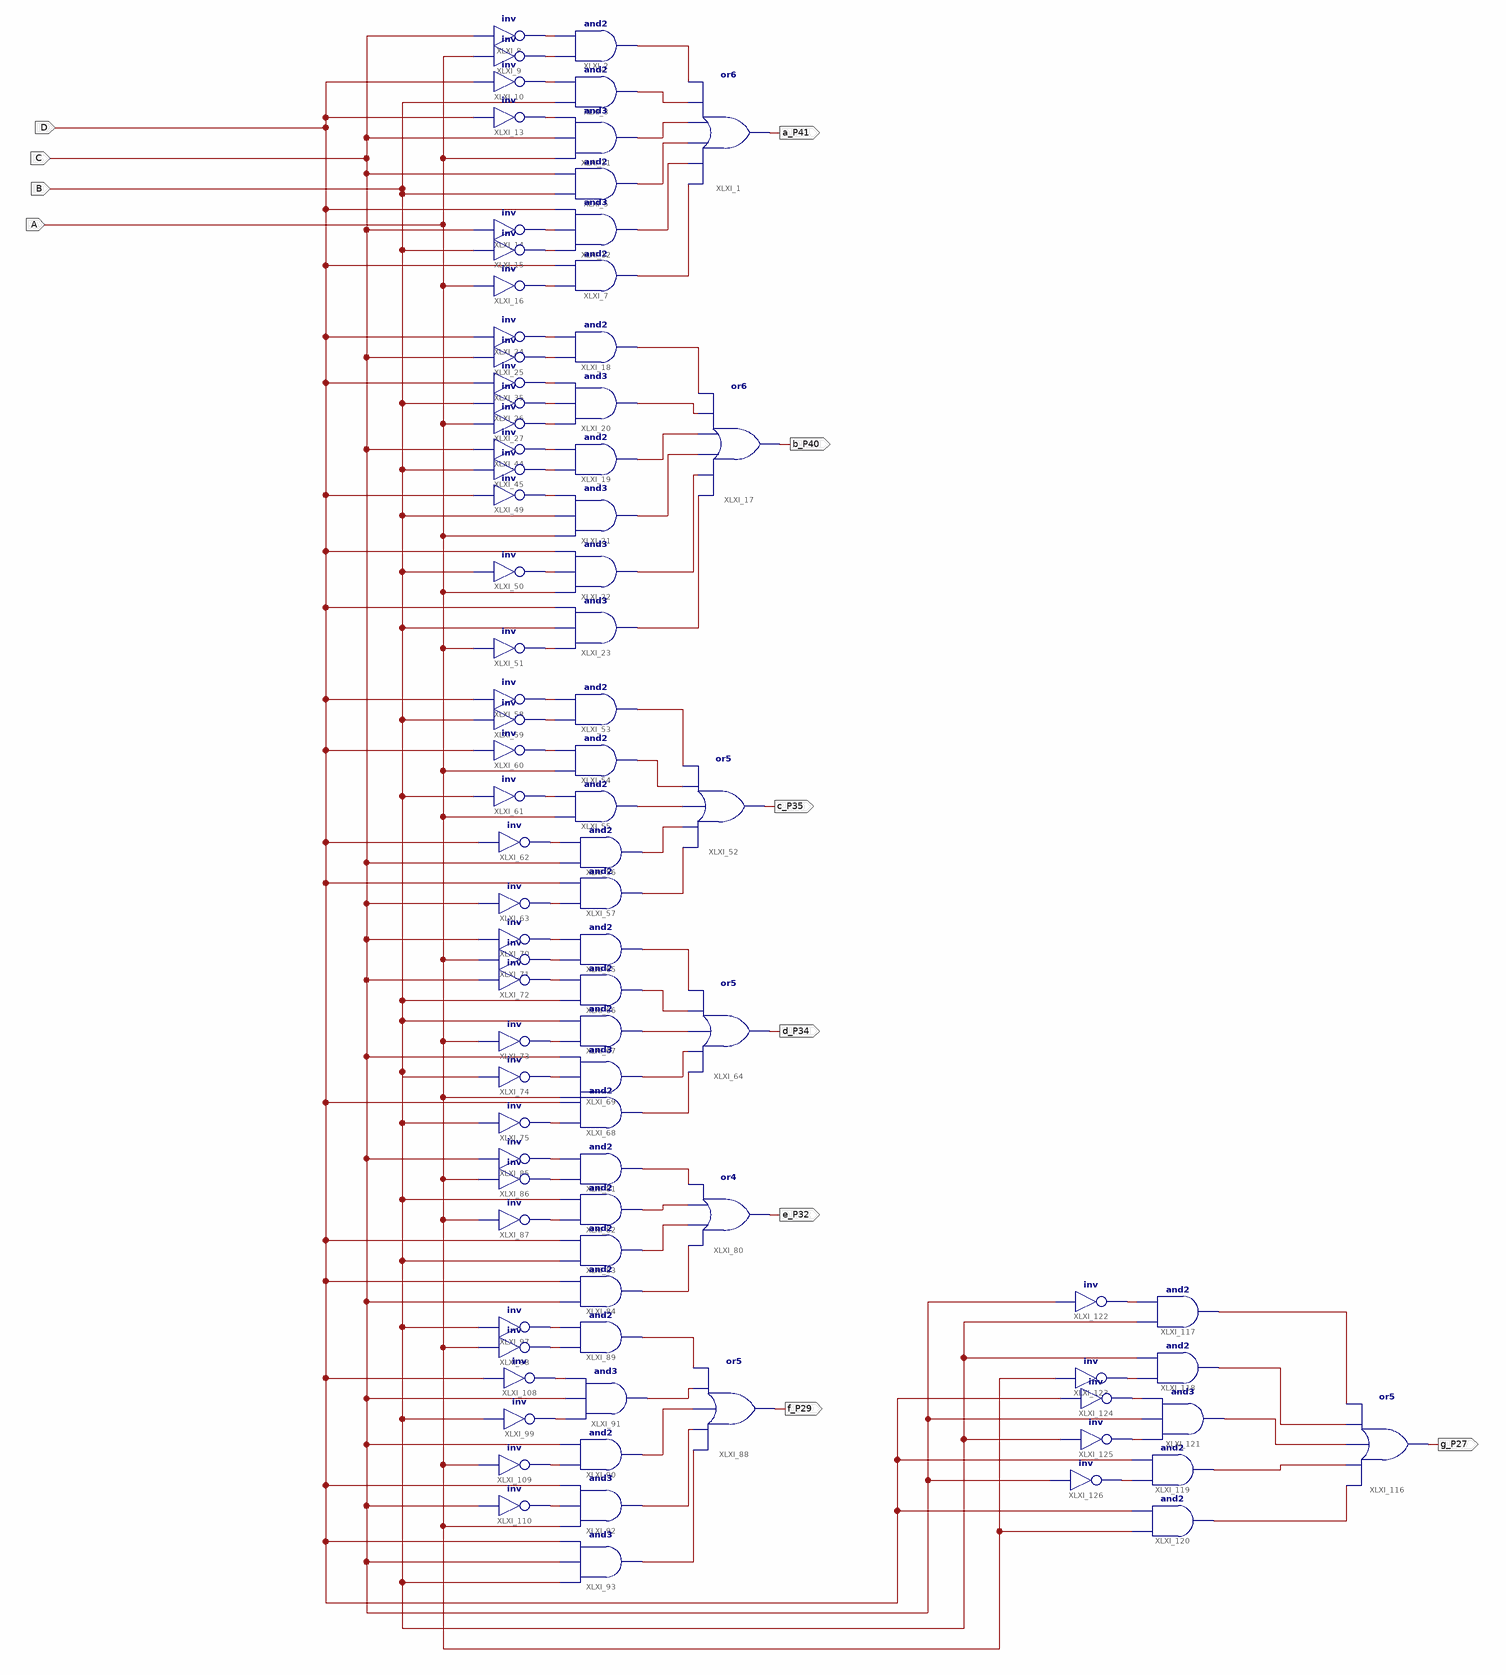
[diagram p0: schematic sheet 1]
// Xilinx ISE schematic segment.sch (spartan6) as structural Verilog: 86 symbols, 11 ports
module segment (
  input  A,
  input  B,
  input  C,
  input  D,
  output a_P41,
  output b_P40,
  output c_P35,
  output d_P34,
  output e_P32,
  output f_P29,
  output g_P27
);

  wire XLXN_2, XLXN_3, XLXN_4, XLXN_5, XLXN_6, XLXN_7, XLXN_8, XLXN_9, XLXN_10, XLXN_11, XLXN_12, XLXN_13,
       XLXN_14, XLXN_27, XLXN_28, XLXN_29, XLXN_30, XLXN_31, XLXN_32, XLXN_33, XLXN_34, XLXN_36, XLXN_37,
       XLXN_41, XLXN_46, XLXN_47, XLXN_49, XLXN_50, XLXN_51, XLXN_69, XLXN_70, XLXN_71, XLXN_72, XLXN_73,
       XLXN_74, XLXN_75, XLXN_76, XLXN_77, XLXN_78, XLXN_79, XLXN_92, XLXN_93, XLXN_94, XLXN_95, XLXN_96,
       XLXN_97, XLXN_98, XLXN_99, XLXN_100, XLXN_101, XLXN_102, XLXN_121, XLXN_122, XLXN_123, XLXN_125,
       XLXN_126, XLXN_127, XLXN_128, XLXN_138, XLXN_139, XLXN_140, XLXN_141, XLXN_142, XLXN_143, XLXN_144,
       XLXN_146, XLXN_151, XLXN_152, XLXN_153, XLXN_171, XLXN_172, XLXN_173, XLXN_174, XLXN_175, XLXN_176,
       XLXN_177, XLXN_178, XLXN_179, XLXN_180;

  or XLXI_1 (a_P41, XLXN_7, XLXN_6, XLXN_5, XLXN_4, XLXN_3, XLXN_2);
  and XLXI_2 (XLXN_2, XLXN_9, XLXN_8);
  and XLXI_3 (XLXN_3, B, XLXN_10);
  and XLXI_5 (XLXN_5, B, C);
  and XLXI_7 (XLXN_7, XLXN_14, D);
  not XLXI_8 (XLXN_8, C);
  not XLXI_9 (XLXN_9, A);
  not XLXI_10 (XLXN_10, D);
  and XLXI_11 (XLXN_4, A, C, XLXN_11);
  and XLXI_12 (XLXN_6, XLXN_13, XLXN_12, D);
  not XLXI_13 (XLXN_11, D);
  not XLXI_14 (XLXN_12, C);
  not XLXI_15 (XLXN_13, B);
  not XLXI_16 (XLXN_14, A);
  or XLXI_17 (b_P40, XLXN_32, XLXN_31, XLXN_30, XLXN_29, XLXN_28, XLXN_27);
  and XLXI_18 (XLXN_27, XLXN_34, XLXN_33);
  not XLXI_24 (XLXN_33, D);
  not XLXI_25 (XLXN_34, C);
  and XLXI_20 (XLXN_28, XLXN_37, XLXN_36, XLXN_41);
  not XLXI_26 (XLXN_36, B);
  not XLXI_27 (XLXN_37, A);
  not XLXI_35 (XLXN_41, D);
  and XLXI_19 (XLXN_29, XLXN_47, XLXN_46);
  not XLXI_44 (XLXN_46, C);
  not XLXI_45 (XLXN_47, B);
  and XLXI_21 (XLXN_30, A, B, XLXN_49);
  and XLXI_22 (XLXN_31, A, XLXN_50, D);
  and XLXI_23 (XLXN_32, XLXN_51, B, D);
  not XLXI_49 (XLXN_49, D);
  not XLXI_50 (XLXN_50, B);
  not XLXI_51 (XLXN_51, A);
  or XLXI_52 (c_P35, XLXN_73, XLXN_72, XLXN_71, XLXN_70, XLXN_69);
  and XLXI_53 (XLXN_69, XLXN_75, XLXN_74);
  and XLXI_54 (XLXN_70, A, XLXN_76);
  and XLXI_55 (XLXN_71, A, XLXN_77);
  and XLXI_56 (XLXN_72, C, XLXN_78);
  and XLXI_57 (XLXN_73, XLXN_79, D);
  not XLXI_58 (XLXN_74, D);
  not XLXI_59 (XLXN_75, B);
  not XLXI_60 (XLXN_76, D);
  not XLXI_61 (XLXN_77, B);
  not XLXI_62 (XLXN_78, D);
  not XLXI_63 (XLXN_79, C);
  or XLXI_64 (d_P34, XLXN_96, XLXN_95, XLXN_94, XLXN_93, XLXN_92);
  and XLXI_65 (XLXN_92, XLXN_98, XLXN_97);
  and XLXI_66 (XLXN_93, B, XLXN_99);
  and XLXI_67 (XLXN_94, XLXN_100, B);
  not XLXI_70 (XLXN_97, C);
  not XLXI_71 (XLXN_98, A);
  not XLXI_72 (XLXN_99, C);
  not XLXI_73 (XLXN_100, A);
  and XLXI_68 (XLXN_96, XLXN_102, D);
  and XLXI_69 (XLXN_95, A, XLXN_101, C);
  not XLXI_74 (XLXN_101, B);
  not XLXI_75 (XLXN_102, B);
  or XLXI_80 (e_P32, XLXN_125, XLXN_123, XLXN_122, XLXN_121);
  and XLXI_81 (XLXN_121, XLXN_127, XLXN_126);
  and XLXI_82 (XLXN_122, XLXN_128, B);
  and XLXI_83 (XLXN_123, B, D);
  and XLXI_84 (XLXN_125, C, D);
  not XLXI_85 (XLXN_126, C);
  not XLXI_86 (XLXN_127, A);
  not XLXI_87 (XLXN_128, A);
  or XLXI_88 (f_P29, XLXN_142, XLXN_141, XLXN_140, XLXN_139, XLXN_138);
  and XLXI_91 (XLXN_139, XLXN_146, C, XLXN_151);
  not XLXI_99 (XLXN_146, B);
  and XLXI_89 (XLXN_138, XLXN_144, XLXN_143);
  not XLXI_97 (XLXN_143, B);
  not XLXI_98 (XLXN_144, A);
  not XLXI_108 (XLXN_151, D);
  and XLXI_90 (XLXN_140, XLXN_152, C);
  and XLXI_92 (XLXN_141, A, XLXN_153, D);
  and XLXI_93 (XLXN_142, B, C, D);
  not XLXI_109 (XLXN_152, A);
  not XLXI_110 (XLXN_153, C);
  or XLXI_116 (g_P27, XLXN_175, XLXN_174, XLXN_173, XLXN_172, XLXN_171);
  and XLXI_117 (XLXN_171, B, XLXN_176);
  and XLXI_118 (XLXN_172, XLXN_177, B);
  and XLXI_119 (XLXN_174, XLXN_180, D);
  and XLXI_120 (XLXN_175, A, D);
  and XLXI_121 (XLXN_173, XLXN_179, C, XLXN_178);
  not XLXI_122 (XLXN_176, C);
  not XLXI_123 (XLXN_177, A);
  not XLXI_124 (XLXN_178, D);
  not XLXI_125 (XLXN_179, B);
  not XLXI_126 (XLXN_180, C);
endmodule
